# EAGLE schematic eTapper1main (EAGLE 8.2.2)
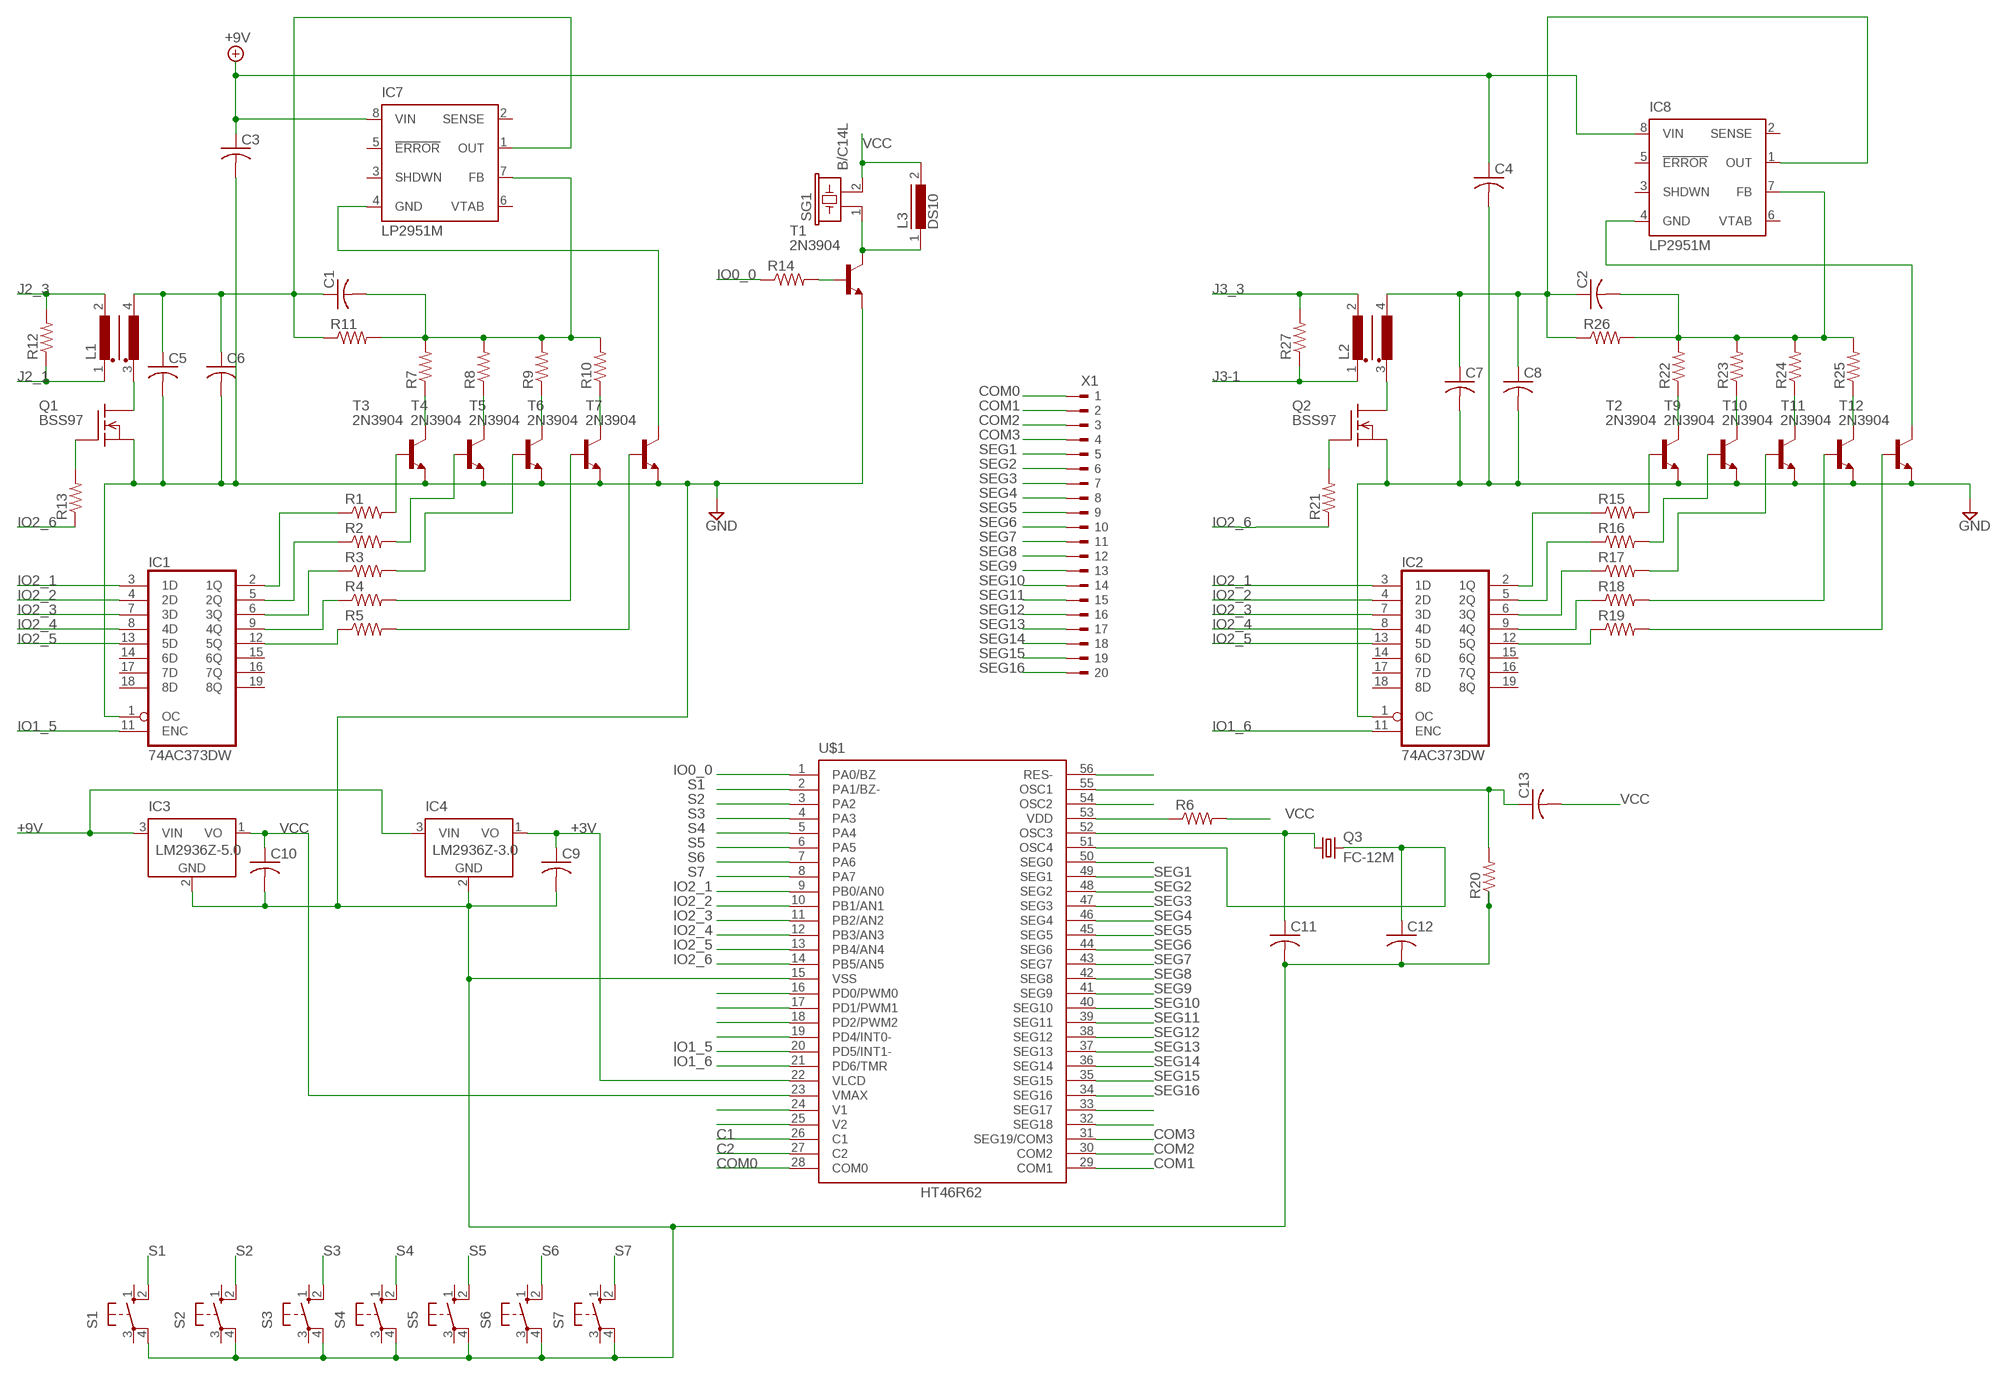
[diagram p0: schematic, sheet 1]

## Parts
C1  C-USC0805  [C0805]
C2  C-USC0805  [C0805]
C3  C-USC0805  [C0805]
C4  C-USC0805  [C0805]
C5  C-USC0805  [C0805]
C6  C-USC0805  [C0805]
C7  C-USC0805  [C0805]
C8  C-USC0805  [C0805]
C9  C-USC0805  [C0805]
C10  C-USC0805  [C0805]
C11  C-USC0805  [C0805]
C12  C-USC0805  [C0805]
C13  C-USC0805  [C0805]
IC1  74AC373DW  [SO20W]
IC2  74AC373DW  [SO20W]
IC3  LM2936Z-5.0  [TO92]
IC4  LM2936Z-3.0  [TO92]
IC7  LP2951M  [SO08]
IC8  LP2951M  [SO08]
L1  SK9-2  [SK9]
L2  SK9-2  [SK9]
L3  DS10  [DS10]
Q1  BSS97  [TO202]
Q2  BSS97  [TO202]
Q3  FC-12M  [FC-12M]
R1  R-US_R0402  [R0402]
R2  R-US_R0402  [R0402]
R3  R-US_R0402  [R0402]
R4  R-US_R0402  [R0402]
R5  R-US_R0402  [R0402]
R6  R-US_R0402  [R0402]
R7  R-US_R0402  [R0402]
R8  R-US_R0402  [R0402]
R9  R-US_R0402  [R0402]
R10  R-US_R0402  [R0402]
R11  R-US_R0402  [R0402]
R12  R-US_R0402  [R0402]
R13  R-US_R0402  [R0402]
R14  R-US_R0402  [R0402]
R15  R-US_R0402  [R0402]
R16  R-US_R0402  [R0402]
R17  R-US_R0402  [R0402]
R18  R-US_R0402  [R0402]
R19  R-US_R0402  [R0402]
R20  R-US_R0402  [R0402]
R21  R-US_R0402  [R0402]
R22  R-US_R0402  [R0402]
R23  R-US_R0402  [R0402]
R24  R-US_R0402  [R0402]
R25  R-US_R0402  [R0402]
R26  R-US_R0402  [R0402]
R27  R-US_R0402  [R0402]
S1  10-XX  [B3F-10XX]
S2  10-XX  [B3F-10XX]
S3  10-XX  [B3F-10XX]
S4  10-XX  [B3F-10XX]
S5  10-XX  [B3F-10XX]
S6  10-XX  [B3F-10XX]
S7  10-XX  [B3F-10XX]
SG1  B/C14L  [B/C14L]
T1  2N3904  [TO92]
T2  2N3904  [TO92]
T3  2N3904  [TO92]
T4  2N3904  [TO92]
T5  2N3904  [TO92]
T6  2N3904  [TO92]
T7  2N3904  [TO92]
T9  2N3904  [TO92]
T10  2N3904  [TO92]
T11  2N3904  [TO92]
T12  2N3904  [TO92]
U$1  HT46R62  [SSOP56]
X1  110-20  [110-20]

## Nets
+3V: C9.1 IC4.1(VO) U$1.22(VLCD)
+9V: C3.1 C4.1 IC3.3(VIN) IC4.3(VIN) IC7.8(VIN) IC8.8(VIN)
C1: U$1.26(C1)
C2: U$1.27(C2)
COM0: U$1.28(COM0) X1.1
COM1: U$1.29(COM1) X1.2
COM2: U$1.30(COM2) X1.3
COM3: U$1.31(SEG19/COM3) X1.4
GND: C3.2 C4.2 C5.2 C6.2 C7.2 C8.2 C9.2 C10.2 C11.2 C12.2 IC3.2(GND) IC4.2(GND) Q1.1(S) Q2.1(S) R20.1 S1.4(P1) S2.4(P1) S3.4(P1) S4.4(P1) S5.4(P1) S6.4(P1) S7.4(P1) T1.3(E) T2.3(E) T3.3(E) T4.3(E) T5.3(E) T6.3(E) T7.3(E) T9.3(E) T10.3(E) T11.3(E) T12.3(E) U$1.15(VSS)
IO0_0: R14.1 U$1.1(PA0/BZ)
IO1_5: IC1.11(ENC) U$1.20(PD5/INT1-)
IO1_6: IC2.11(ENC) U$1.21(PD6/TMR)
IO2_1: IC1.3(1D) IC2.3(1D) U$1.9(PB0/AN0)
IO2_2: IC1.4(2D) IC2.4(2D) U$1.10(PB1/AN1)
IO2_3: IC1.7(3D) IC2.7(3D) U$1.11(PB2/AN2)
IO2_4: IC1.8(4D) IC2.8(4D) U$1.12(PB3/AN3)
IO2_5: IC1.13(5D) IC2.13(5D) U$1.13(PB4/AN4)
IO2_6: R13.1 R21.1 U$1.14(PB5/AN5)
J2_1: L1.1(W1A) R12.1
J2_3: L1.2(W1E) R12.2
J3-1: L2.1(W1A) R27.1
J3_3: L2.2(W1E) R27.2
N$1: IC1.2(1Q) R1.1
N$2: IC1.5(2Q) R2.1
N$3: IC1.6(3Q) R3.1
N$4: IC1.9(4Q) R4.1
N$5: IC1.12(5Q) R5.1
N$6: L3.1 SG1.1 T1.1(C)
N$7: R4.2 T6.2(B)
N$8: R5.2 T7.2(B)
N$10: R7.1 T3.1(C)
N$11: R8.1 T4.1(C)
N$12: R9.1 T5.1(C)
N$13: R1.2 T3.2(B)
N$14: R2.2 T4.2(B)
N$15: R3.2 T5.2(B)
N$16: R10.1 T6.1(C)
N$17: C1.2 IC7.7(FB) R7.2 R8.2 R9.2 R10.2 R11.2
N$18: C1.1 C5.1 C6.1 IC7.1(OUT) L1.4(W2E) R11.1
N$19: L1.3(W2A) Q1.2(D)
N$20: IC2.2(1Q) R15.1
N$21: Q1.3(G) R13.2
N$22: R14.2 T1.2(B)
N$24: IC2.5(2Q) R16.1
N$25: IC2.6(3Q) R17.1
N$26: IC2.9(4Q) R18.1
N$27: IC2.12(5Q) R19.1
N$29: R15.2 T2.2(B)
N$30: R16.2 T9.2(B)
N$31: R17.2 T10.2(B)
N$32: R18.2 T11.2(B)
N$33: R19.2 T12.2(B)
N$35: R22.1 T2.1(C)
N$36: R23.1 T9.1(C)
N$37: R24.1 T10.1(C)
N$38: R25.1 T11.1(C)
N$39: C2.2 IC8.7(FB) R22.2 R23.2 R24.2 R25.2 R26.2
N$40: C2.1 C7.1 C8.1 IC8.1(OUT) L2.4(W2E) R26.1
N$41: L2.3(W2A) Q2.2(D)
N$42: Q2.3(G) R21.2
N$45: IC7.4(GND) T7.1(C)
N$47: IC8.4(GND) T12.1(C)
N$55: U$1.16(PD0/PWM0)
N$56: U$1.17(PD1/PWM1)
N$57: U$1.18(PD2/PWM2)
N$58: U$1.19(PD4/INT0-)
N$63: U$1.24(V1)
N$64: U$1.25(V2)
N$71: U$1.32(SEG18)
N$72: U$1.33(SEG17)
N$89: U$1.50(SEG0)
N$90: C12.1 Q3.2 U$1.51(OSC4)
N$91: C11.1 Q3.1 U$1.52(OSC3)
N$92: R6.1 U$1.53(VDD)
N$93: U$1.54(OSC2)
N$94: C13.1 R20.2 U$1.55(OSC1)
N$95: U$1.56(RES-)
S1: S1.2(S1) U$1.2(PA1/BZ-)
S2: S2.2(S1) U$1.3(PA2)
S3: S3.2(S1) U$1.4(PA3)
S4: S4.2(S1) U$1.5(PA4)
S5: S5.2(S1) U$1.6(PA5)
S6: S6.2(S1) U$1.7(PA6)
S7: S7.2(S1) U$1.8(PA7)
SEG1: U$1.49(SEG1) X1.5
SEG2: U$1.48(SEG2) X1.6
SEG3: U$1.47(SEG3) X1.7
SEG4: U$1.46(SEG4) X1.8
SEG5: U$1.45(SEG5) X1.9
SEG6: U$1.44(SEG6) X1.10
SEG7: U$1.43(SEG7) X1.11
SEG8: U$1.42(SEG8) X1.12
SEG9: U$1.41(SEG9) X1.13
SEG10: U$1.40(SEG10) X1.14
SEG11: U$1.39(SEG11) X1.15
SEG12: U$1.38(SEG12) X1.16
SEG13: U$1.37(SEG13) X1.17
SEG14: U$1.36(SEG14) X1.18
SEG15: U$1.35(SEG15) X1.19
SEG16: U$1.34(SEG16) X1.20
VCC: C10.1 C13.2 IC3.1(VO) L3.2 R6.2 SG1.2 U$1.23(VMAX)
Unconnected: IC1.1(OC) IC1.14(6D) IC1.15(6Q) IC1.16(7Q) IC1.17(7D) IC1.18(8D) IC1.19(8Q) IC2.1(OC) IC2.14(6D) IC2.15(6Q) IC2.16(7Q) IC2.17(7D) IC2.18(8D) IC2.19(8Q) IC7.2(SENSE) IC7.3(SHDWN) IC7.5(!ERROR) IC7.6(VTAB) IC8.2(SENSE) IC8.3(SHDWN) IC8.5(!ERROR) IC8.6(VTAB) S1.1(S) S1.3(P) S2.1(S) S2.3(P) S3.1(S) S3.3(P) S4.1(S) S4.3(P) S5.1(S) S5.3(P) S6.1(S) S6.3(P) S7.1(S) S7.3(P)

## Power pins joined to a net without a drawn wire
GND: IC1.10(GND) IC2.10(GND)
VCC: IC1.20(VCC) IC2.20(VCC)

## Library data of the parts
C1-C13 = rcl:C-US: CAPACITOR, American symbol
IC1 IC2 = 74xx-eu:74*373: Octal D type transparent LATCH, edge triggered
IC3 = national-semiconductor:LM2936?*: Ultra-Low Quiescent Current LDO Voltage Regulator Source: Data sheet <http://www.national.com/ds/LM/LM2936.pdf>; MF: NATIONAL SEMICONDUCTOR; MPN: LM2936Z-5.0/NOPB; OC_FARNELL: 1150143; OC_NEWARK: 41K4533
IC4 = national-semiconductor:LM2936?*: Ultra-Low Quiescent Current LDO Voltage Regulator Source: Data sheet <http://www.national.com/ds/LM/LM2936.pdf>; MF: NATIONAL SEMICONDUCTOR; MPN: LM2936Z-3.0/NOPB; OC_FARNELL: 1312709; OC_NEWARK: 41K4531
IC7 IC8 = national-semiconductor:LP2951: Adjustable Micropower Voltage Regulator Source: http://www.national.com/ds/LP/LP2950.pdf; MF: FAIRCHILD SEMICONDUCTOR; MPN: LP2951CM; OC_FARNELL: 9488561; OC_NEWARK: 78K6014
L1 L2 = trafo-siemens:SK9-2: TRANSFORMER; OC_FARNELL: unknown; OC_NEWARK: unknown
L3 = inductors:DS10: INDUCTOR
Q1 Q2 = transistor-fet:BSS97: N-Channel Enhancement MOSFET 200V; 1.5A; 1,6Ohm
Q3 = crystal:FC-12M: kHz RANGE CRYSTAL UNIT LOW PROFILE SMD Source: Epson Toyocom FC-12M.pdf
R1-R27 = resistor:R-US_: RESISTOR, American symbol
S1-S7 = switch-omron:10-XX: OMRON SWITCH; MPN: B3F-1000; OC_FARNELL: 176432; OC_NEWARK: 36M3542
SG1 = buzzer:B/C14L: BUZZER Source: Buerklin; OC_FARNELL: unknown; OC_NEWARK: unknown
T1-T7 T9-T12 = transistor-neu-to92:2N3904: NPN TRANSISTOR
U$1 = HT46R62:HT46R62: Holtek HT46R62 A/D with LCD Type 8 Bit MCU
X1 = con-weidmueller-sl35:110-20: WEIDMUELLER CLAMP CONNECTOR; OC_FARNELL: unknown; OC_NEWARK: unknown

## Module LP2951
Ports: 

### Library data of the parts